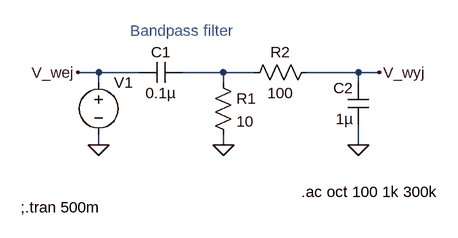
[diagram p0: schematic bandpass.asc]
bandpass.asc, the LTspice schematic file:
Version 4
SHEET 1 880 680
WIRE -32 160 -64 160
WIRE 32 160 -32 160
WIRE 160 160 96 160
WIRE 208 160 160 160
WIRE 368 160 288 160
WIRE 400 160 368 160
WIRE -32 176 -32 160
WIRE 160 176 160 160
WIRE 368 176 368 160
WIRE -32 272 -32 256
WIRE 160 272 160 256
WIRE 368 272 368 240
FLAG 368 272 0
FLAG 160 272 0
FLAG -32 272 0
FLAG -64 160 V_wej
FLAG 400 160 V_wyj
SYMBOL res 144 160 R0
SYMATTR InstName R1
SYMATTR Value 10
SYMATTR SpiceLine tol=1 pwr=0.1
SYMBOL res 304 144 R90
WINDOW 0 0 56 VBottom 2
WINDOW 3 32 56 VTop 2
SYMATTR InstName R2
SYMATTR Value 100
SYMATTR SpiceLine tol=1 pwr=0.1
SYMBOL cap 96 144 R90
WINDOW 0 0 32 VBottom 2
WINDOW 3 32 32 VTop 2
SYMATTR InstName C1
SYMATTR Value 0.1µ
SYMATTR SpiceLine V=16 Irms=5.18 Rser=0 Lser=0
SYMBOL cap 384 240 R180
WINDOW 0 24 56 Left 2
WINDOW 3 24 8 Left 2
SYMATTR InstName C2
SYMATTR Value 1µ
SYMATTR SpiceLine V=200 Irms=5.67 Rser=0 Lser=0
SYMBOL voltage -32 160 R0
WINDOW 3 24 44 Left 2
WINDOW 39 0 0 Left 0
SYMATTR Value ""
SYMATTR InstName V1
SYMATTR Value2 AC 1
TEXT 280 344 Left 2 !.ac oct 100 1k 300k
TEXT -152 368 Left 2 !;.tran 500m
TEXT 16 96 Left 2 ;Bandpass filter

The netlist it stands for:
* bandpass.asc
R1 N001 0 10 tol=1 pwr=0.1
R2 V_wyj N001 100 tol=1 pwr=0.1
C1 N001 V_wej 0.1µ V=16 Irms=5.18 Rser=0 Lser=0
C2 0 V_wyj 1µ V=200 Irms=5.67 Rser=0 Lser=0
V1 V_wej 0 AC 1
.ac oct 100 1k 300k
;.tran 500m
* Bandpass filter
.backanno
.end